# Altium schematic sheet CAN.SchDoc
size B; SheetNumber: 6; SheetTotal: 15
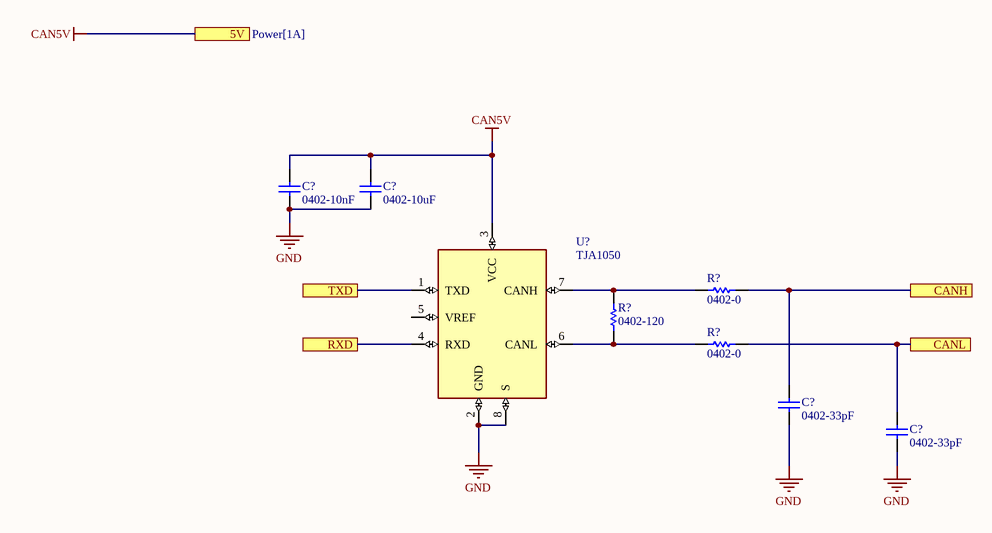
[diagram p0: CAN.SchDoc]

## Parts
(Parts that share a designator on the sheet are numbered #1, #2 ... from top to bottom, then left to right.)
C?#1  0402-10nF  [CAPC0402(1005)60_N]
C?#2  0402-10uF  [CAPC0402(1005)60_N]
C?#3  0402-33pF  [CAPC0402(1005)60_N]
C?#4  0402-33pF  [CAPC0402(1005)60_N]
R?#1  0402-0  [R-0402-1K]
R?#2  0402-120  [R-0402-1K]
R?#3  0402-0  [R-0402-1K]
U?  TJA1050  [SOP8]

## Ports
5V (see Power[1A]), CANH, CANL, RXD, TXD

## Nets
CAN5V: C?#1.2 C?#2.2 U?.3(VCC) ; port 5V
GND: C?#1.1 C?#2.1 C?#3.1 C?#4.1 U?.2(GND) U?.8(S)
CANH: C?#3.2 R?#1.2 ; port CANH
CANL: C?#4.2 R?#3.2 ; port CANL
RXD: U?.4(RXD) ; port RXD
TXD: U?.1(TXD) ; port TXD
NetR?#1_1: R?#1.1 R?#2.2 U?.7(CANH)
NetR?#2_1: R?#2.1 R?#3.1 U?.6(CANL)

Not connected (* = marked no-connect by the designer): U? 5(VREF)

## Library data of the parts
C?#1 = CMP-001-00355-4: Capacitor 10nF 0402; Tolerance: 20%; Dielectric: X5R; Voltage Rating (DC): 4V; Height: 0.5mm; Mount: Surface Mount; Min Operating Temperature: -55°C; Max Operating Temperature: 85°C; RoHS Compliant: Yes; Source: 0402-10uF.SchLib; Width: 0.02inch; Pins: 2; Value: 10nF; Case/Package: 0402; Halogen Free: Halogen Free; Case Code (Metric): 1005; Construction: Flat; Termination: SMD/SMT; Design Item ID: CMP-1034-02139-2; Component Type: Standard; Thickness: 0.028inch; Packaging: Tape and Reel; Series: M; Package Quantity: 1; Length: 0.039inch; Voltage Rating: 4V
C?#2 = CMP-001-00352-3: Capacitor 10uF 0402s; Tolerance: 20%; Value: 10µF; Dielectric: X5R; Voltage Rating (DC): 4V; Width: 0.02inch; Packaging: Tape and Reel; RoHS Compliant: Yes; Series: M; Mount: Surface Mount; Termination: SMD/SMT; Source: 0402-10uF.SchLib; Design Item ID: CMP-1034-02139-2; Min Operating Temperature: -55°C; Construction: Flat; Component Type: Standard; Case Code (Metric): 1005; Length: 0.039inch; Height: 0.5mm; Pins: 2; Thickness: 0.028inch; Voltage Rating: 4V; Package Quantity: 1; Max Operating Temperature: 85°C; Halogen Free: Halogen Free; Case/Package: 0402
C?#3 C?#4 = CMP-001-00369-1: Capacitor 33pF 0402; Voltage Rating (DC): 4V; Tolerance: 20%; Dielectric: X5R; Termination: SMD/SMT; Voltage Rating: 4V; Case Code (Metric): 1005; Design Item ID: CMP-1034-02139-2; Height: 0.5mm; Max Operating Temperature: 85°C; Thickness: 0.028inch; Construction: Flat; Mount: Surface Mount; Min Operating Temperature: -55°C; Series: M; Package Quantity: 1; Pins: 2; Case/Package: 0402; Length: 0.039inch; Value: 33pF; Width: 0.02inch; Component Type: Standard; RoHS Compliant: Yes; Halogen Free: Halogen Free; Source: 0402-10uF.SchLib; Packaging: Tape and Reel
R?#1 R?#3 = CMP-009-00678-4: 0402Resistor 0 Ohm; Value: 0
R?#2 = CMP-009-00679-1: 0402Resistor 120Ohm; Value: 120
U? = CMP-016-000000-1: 1/1 Transceiver Half CANbus 8-SO; MF: NXP USA; MP: TJA1050; Value: *; Purchase-URL: https://pricing.snapeda.com/search/part/TJA1050/?ref=eda; SnapEDA_Link: https://www.snapeda.com/parts/TJA1050/NXP%20USA%20Inc./view-part/562764/?ref=snap; Price: None; Check_prices: https://www.snapeda.com/parts/TJA1050/NXP%20USA%20Inc./view-part/562764/?ref=eda; Availability: In Stock; Source: TJA1050.SchLib; Design Item ID: TJA1050; Package: SOIC-8 NXP Semiconductors